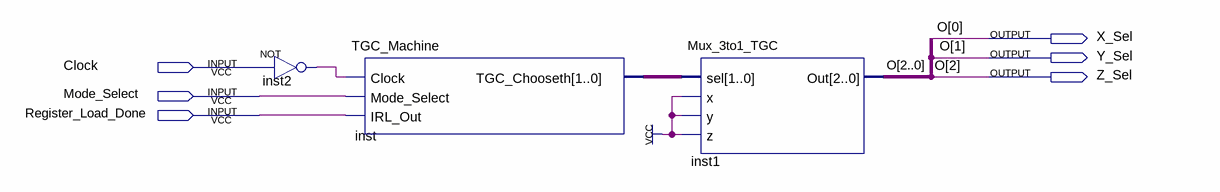
[diagram p0: schematic sheet]
// Quartus schematic TGC_Test.bdf as structural Verilog: 3 symbols, 6 pins
module TGC_Test (
  input  Clock,
  input  Mode_Select,
  input  Register_Load_Done,
  output X_Sel,
  output Y_Sel,
  output Z_Sel
);

  wire inst2_out;
  wire [1:0] inst_tgc_chooseth;

  not inst2 (inst2_out, Clock);
  TGC_Machine inst (
    .Clock(inst2_out), .Mode_Select(Mode_Select), .IRL_Out(Register_Load_Done),
    .TGC_Chooseth(inst_tgc_chooseth));
  Mux_3to1_TGC inst1 (.sel(inst_tgc_chooseth), .x(1'b1), .y(1'b1), .z(1'b1), .Out({Z_Sel, Y_Sel, X_Sel}));

  // Other names for the same wires on the sheet: O[2:0] = {Z_Sel, Y_Sel, X_Sel}
endmodule
